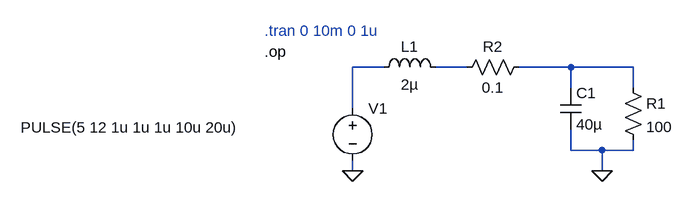
[diagram p0: schematic Draft2.asc]
Draft2.asc, the LTspice schematic file:
Version 4.1
SHEET 1 880 680
WIRE -144 16 -192 16
WIRE -16 16 -64 16
WIRE 144 16 64 16
WIRE 240 16 144 16
WIRE 144 48 144 16
WIRE 240 48 240 16
WIRE -192 80 -192 16
WIRE 144 144 144 112
WIRE 192 144 144 144
WIRE 240 144 240 128
WIRE 240 144 192 144
WIRE -192 176 -192 160
WIRE 192 176 192 144
FLAG 192 176 0
FLAG -192 176 0
SYMBOL voltage -192 64 R0
WINDOW 3 -511 45 Left 2
WINDOW 123 0 0 Left 0
WINDOW 39 0 0 Left 0
SYMATTR Value PULSE(5 12 1u 1u 1u 10u 20u)
SYMATTR InstName V1
SYMBOL ind -160 32 R270
WINDOW 0 32 56 VTop 2
WINDOW 3 5 56 VBottom 2
SYMATTR InstName L1
SYMATTR Value 2µ
SYMATTR SpiceLine Rser=0
SYMBOL cap 128 48 R0
SYMATTR InstName C1
SYMATTR Value 40µ
SYMBOL res 224 32 R0
SYMATTR InstName R1
SYMATTR Value 100
SYMBOL res 80 0 R90
WINDOW 0 0 56 VBottom 2
WINDOW 3 32 56 VTop 2
SYMATTR InstName R2
SYMATTR Value 0.1
TEXT -328 -40 Left 2 ;.tran 0 10m 0 1u
TEXT -328 -8 Left 2 !.op

The netlist it stands for:
* Draft2.asc
V1 N001 0 PULSE(5 12 1u 1u 1u 10u 20u)
L1 N001 N002 2µ Rser=0
C1 N003 0 40µ
R1 N003 0 100
R2 N003 N002 0.1
* .tran 0 10m 0 1u
.op
.backanno
.end